# EAGLE design ArdLedRing (EAGLE 7.4.0)
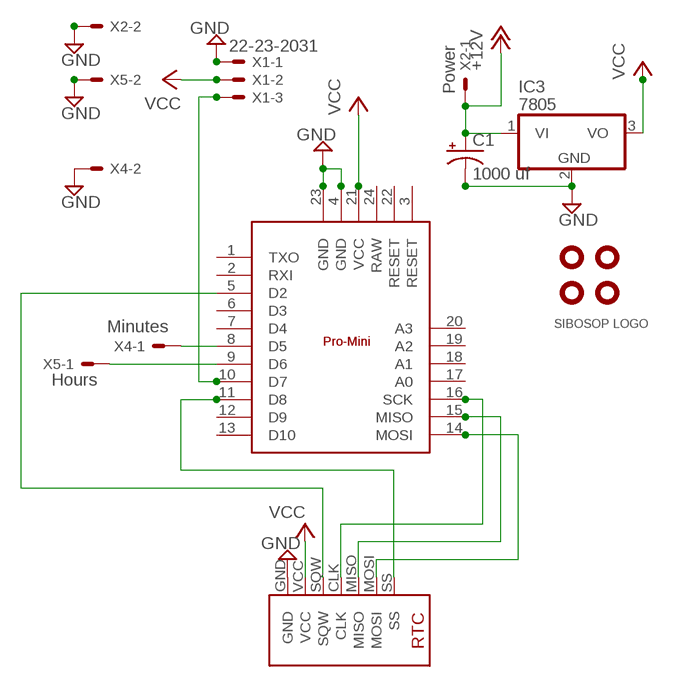
[diagram p0: schematic, sheet 1]

## Parts
C1  1000 uf  CPOL-USE3.5-10  [E3,5-10]
IC1  PRO-MINI  [DIL24-6-EXT]
IC2  SPARKRTC  [SPARKRTC]
IC3  7805  [TO220V]
U$1  LOGO  [LOGO]
U$2  HOLE-125  [HOLE-125]
U$3  HOLE-125  [HOLE-125]
U$4  HOLE-125  [HOLE-125]
U$5  HOLE-125  [HOLE-125]
X1  22-23-2031  [22-23-2031]
X2  Power  22-23-2021  [22-23-2021]
X4  Minutes  22-23-2021  [22-23-2021]
X5  Hours  22-23-2021  [22-23-2021]

## Nets
+12V: C1.+ IC3.1(VI) X2.1
GND: C1.- IC1.4(GND) IC1.23(GND) IC2.GND IC3.2(GND) X1.1 X2.2 X4.2 X5.2
N$1: IC1.8(D5) X4.1
N$2: IC1.9(D6) X5.1
N$3: IC1.5(D2) IC2.SQW
N$4: IC1.16(SCK) IC2.CLK
N$5: IC1.15(MISO) IC2.MISO
N$6: IC1.14(MOSI) IC2.MOSI
N$7: IC1.11(D8) IC2.SS
N$8: IC1.10(D7) X1.3
VCC: IC1.21(VCC) IC2.VCC IC3.3(VO) X1.2
Unconnected: IC1.1(TXO) IC1.2(RXI) IC1.3(RESET) IC1.6(D3) IC1.7(D4) IC1.12(D9) IC1.13(D10) IC1.17(A0) IC1.18(A1) IC1.19(A2) IC1.20(A3) IC1.22(RESET)

## Power pins joined to a net without a drawn wire
RAW: IC1.24(RAW)

## Library data of the parts
C1 = rcl:CPOL-US: POLARIZED CAPACITOR, American symbol
IC1 = sibosop:PRO-MINI
IC2 = sibosop:SPARKRTC: spark fun deadon rtc breakout board
IC3 = kmarx1:78*: 78xx Family - Positive voltage regulator
U$1 = sibosop:LOGO
U$2-U$5 = sibosop:HOLE-125
X1 = sibosop-con-molex:22-23-2031: .100" (2.54mm) Center Header - 3 Pin
X2 X4 X5 = sibosop-con-molex:22-23-2021: .100" (2.54mm) Center Header - 2 Pin

## Board
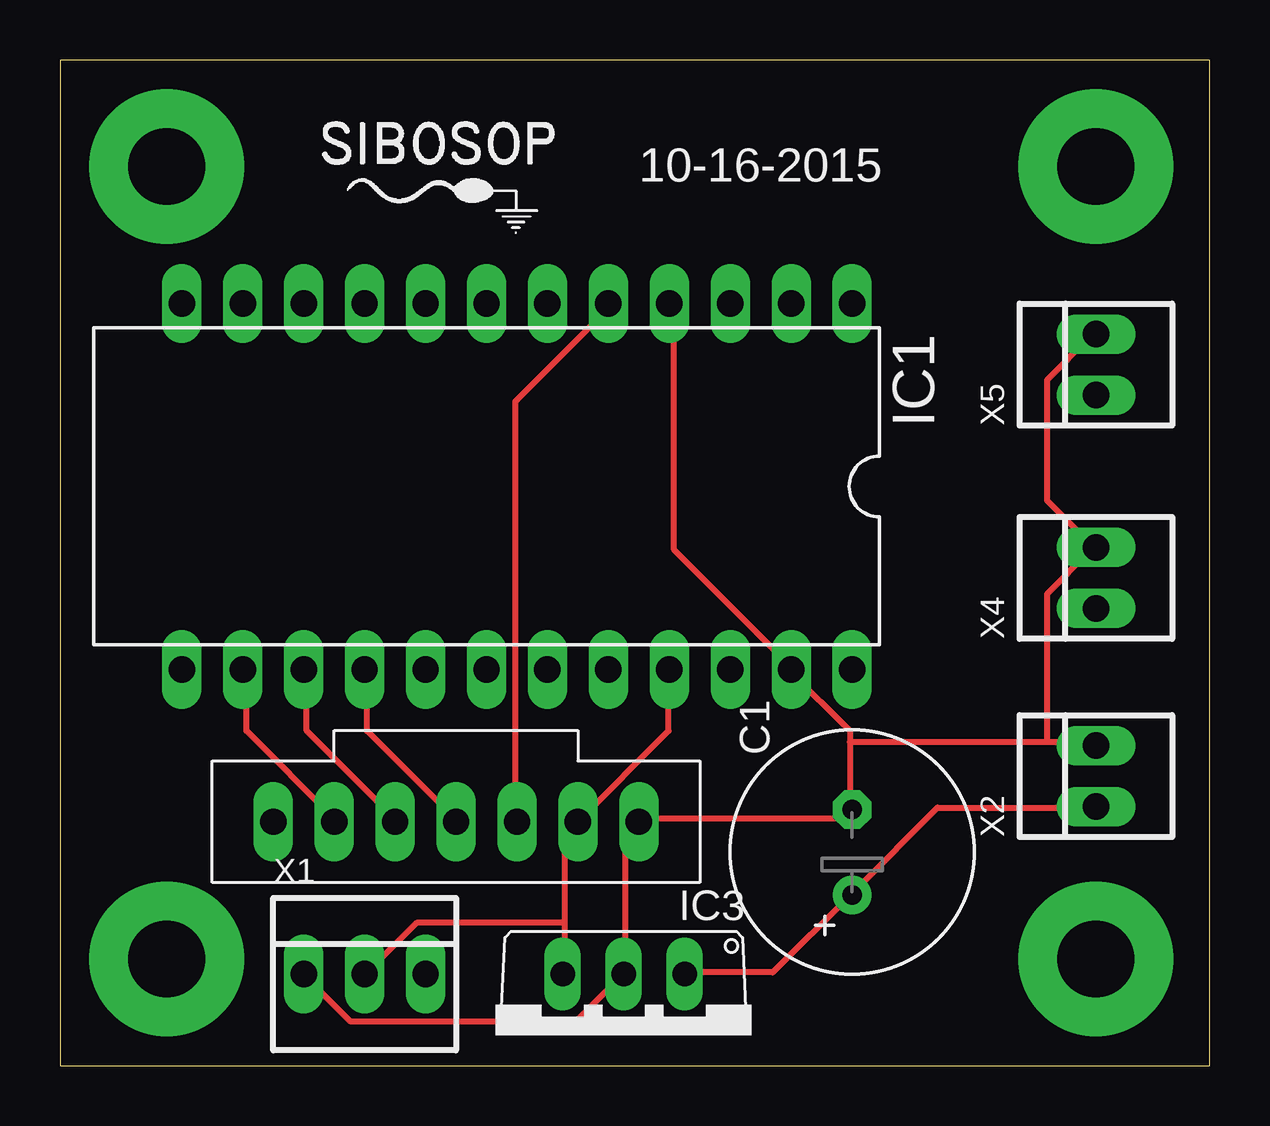
[diagram p1: board, top side]
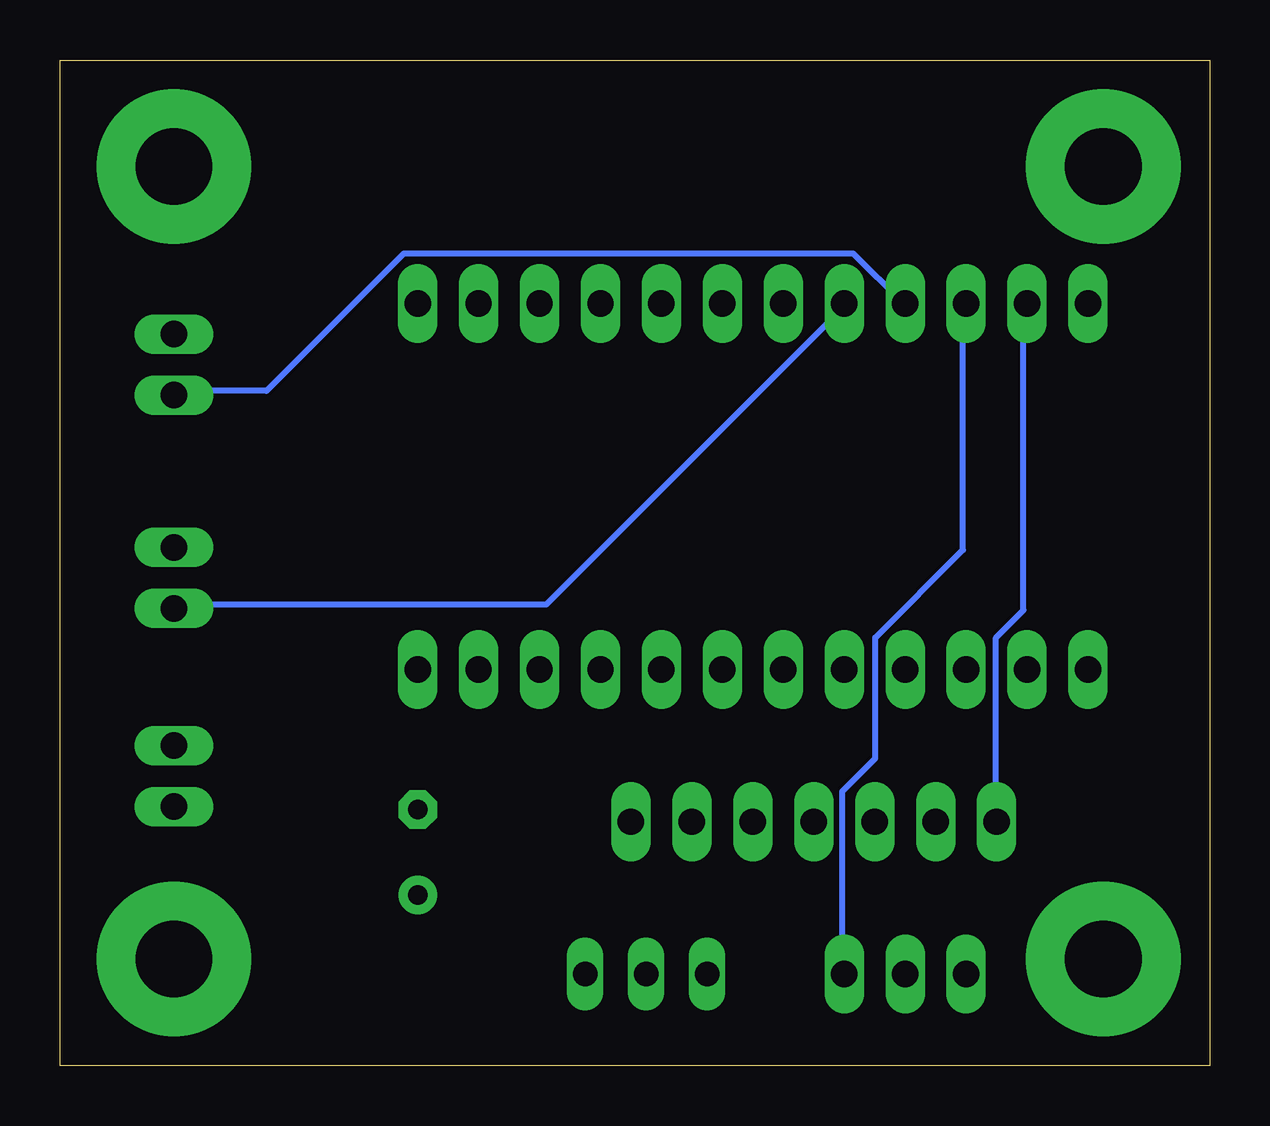
[diagram p2: board, bottom side, seen from below]

Size 47.93 x 41.9 mm. Coordinates in mm from the lower left corner, seen from the top.
Outline: 0,0 47.93,0 47.93,41.9 0,41.9 0,0
Copper layers (1*16): Top 0.035mm / dielectric 1.5mm / Bottom 0.035mm
Design rules "default": minimum track width 10mil, minimum drill 24mil, track to track 8mil, track to pad 8mil, pad to pad 8mil, via to via 8mil, smd to smd 8mil, copper to edge 40mil, drill to drill 8mil, minimum pad ring 10mil, minimum via ring 8mil, stop-mask expansion 4mil, vias tented up to drill 0mil, thermal gap 10mil

### Footprints (pad centres in the part's own frame; a part is rotated, then mirrored left to right if it is on the bottom)
E3,5-10 = drill 0.813 pad 1.6: + -1.778,0 | drill 0.813 pad 1.6 octagon: - 1.778,0
DIL24-6-EXT = drill 1.1 long: 1 -12.7,-7.62; 2 -10.16,-7.62; 3 -7.62,-7.62; 4 -5.08,-7.62; 5 -2.54,-7.62; 6 0,-7.62; 7 2.54,-7.62; 8 5.08,-7.62; 9 7.62,-7.62; 10 10.16,-7.62; 11 12.7,-7.62; 12 15.24,-7.62; 13 15.24,7.62; 14 12.7,7.62; 15 10.16,7.62; 16 7.62,7.62; 17 5.08,7.62; 18 2.54,7.62; 19 0,7.62; 20 -2.54,7.62; 21 -5.08,7.62; 22 -7.62,7.62; 23 -10.16,7.62; 24 -12.7,7.62
SPARKRTC = drill 1.1 long: CLK 0,0; GND 0,-7.62; MISO 0,2.54; MOSI 0,5.08; SQW 0,-2.54; SS 0,7.62; VCC 0,-5.08
TO220V = drill 1.016 long: 1 -2.54,0; 2 0,0; 3 2.54,0
HOLE-125 = drill 3.2 pad 6.452: P$1 0,0
22-23-2031 = drill 1.1 long: 1 -2.54,0; 2 0,0; 3 2.54,0
22-23-2021 = drill 1.1 long: 1 -1.27,0; 2 1.27,0

### Placement (x,y rotation side)
C1  33.02,8.89 90 top
IC1  20.32,24.13 180 top
IC2  16.51,10.16 90 top
IC3  23.5,3.81 180 top
U$1  15.24,38.1 0 top
U$2  4.45,37.47 0 top
U$3  4.45,4.45 0 top
U$4  43.18,4.45 0 top
U$5  43.18,37.47 0 top
X1  12.7,3.81 0 top
X2  43.18,12.06 90 top
X4  43.18,20.32 90 top
X5  43.18,29.21 90 top

### Tracks (layer width: path | path; a pad name or v marks a point on that pad's centre or on a via)
+12V
  Top 0.254: IC3.1 26.06,3.89 29.72,3.89 32.92,7.09 C1.+ 33.15,7.32 36.58,10.74 42.98,10.74 X2.1
GND
  Top 0.254: X1.1 10.29,3.66 12.12,1.83 21.49,1.83 23.32,3.66 IC3.2 23.55,3.89 23.55,9.6 24,10.06 IC2.GND 24.23,10.29 32.69,10.29 32.92,10.52 C1.- 32.92,10.74 32.92,13.49 | 43.2,30.63 X5.2 42.98,30.4 41.15,28.57 41.15,23.55 42.98,21.72 X4.2 42.98,21.49 41.15,19.66 41.15,13.49 | 32.92,13.49 32.92,13.95 30.4,16.46 IC1.23 30.4,16.69 25.6,21.49 25.6,31.55 IC1.4 | 32.92,13.49 41.15,13.49 | 41.15,13.49 42.98,13.49 X2.2
N$1
  Bottom 0.254: X4.1 42.98,19.2 27.66,19.2 15.32,31.55 IC1.8
N$2
  Bottom 0.254: X5.1 42.98,28.12 39.32,28.12 33.6,33.83 14.86,33.83 12.8,31.77 IC1.9
N$3
  Top 0.254: IC2.SQW 18.97,10.29 18.97,27.66 22.86,31.55 IC1.5
N$4
  Top 0.254: IC1.16 12.8,16.46 12.8,13.95 16.46,10.29 IC2.CLK
N$5
  Top 0.254: IC1.15 10.29,16.46 10.29,13.95 13.95,10.29 IC2.MISO
N$6
  Top 0.254: IC1.14 7.77,16.46 7.77,13.95 11.43,10.29 IC2.MOSI
N$7
  Bottom 0.254: IC1.11 7.77,31.55 7.77,18.97 8.91,17.83 8.91,10.29 IC2.SS
N$8
  Bottom 0.254: IC1.10 10.29,31.55 10.29,21.49 13.95,17.83 13.95,12.8 15.32,11.43 15.32,3.89 X1.3
VCC
  Top 0.254: 21.03,5.94 21.03,9.6 IC2.VCC 25.38,13.95 25.38,16.46 IC1.21 | 21.03,5.94 21.03,3.89 IC3.3 | 21.03,5.94 14.86,5.94 12.8,3.89 X1.2

### Text on the board
tPlace: 10-16-2015